# EAGLE schematic PGA2311module (EAGLE 6.4)
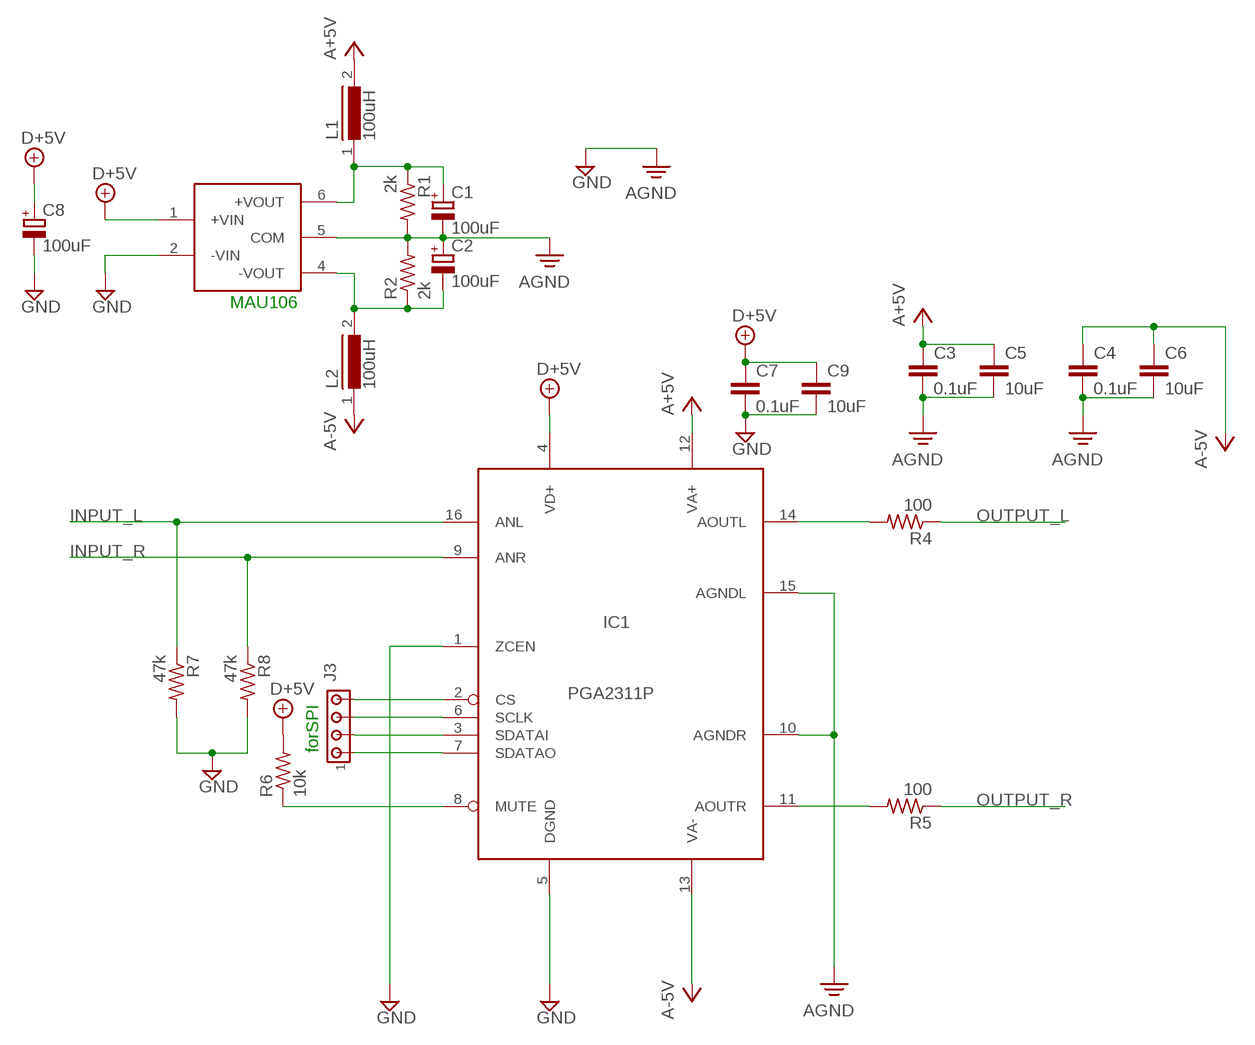
[diagram p0: schematic, sheet 1]

## Parts
C1  100uF  CPOL-EUE5-8.5  [E5-8,5]
C2  100uF  CPOL-EUE5-8.5  [E5-8,5]
C3  0.1uF  C-EU050-030X075  [C050-030X075]
C4  0.1uF  C-EU050-030X075  [C050-030X075]
C5  10uF  C-EU050-030X075  [C050-030X075]
C6  10uF  C-EU050-030X075  [C050-030X075]
C7  0.1uF  C-EU050-030X075  [C050-030X075]
C8  100uF  CPOL-EUE5-8.5  [E5-8,5]
C9  10uF  C-EU050-030X075  [C050-030X075]
IC1  PGA2311P  [DIL16]
J3  MTA04-156  [1X4MTA]
L1  100uH  82114R  [82114R]
L2  100uH  82114R  [82114R]
R1  2k  R-US_0411/15  [0411/15]
R2  2k  R-US_0411/15  [0411/15]
R4  100  R-US_0411/15  [0411/15]
R5  100  R-US_0411/15  [0411/15]
R6  10k  R-US_0411/15  [0411/15]
R7  47k  R-US_0411/15  [0411/15]
R8  47k  R-US_0411/15  [0411/15]
U$1  MAU106  [MAU106]

## Nets
+5V: C7.1 C8.+ C9.1 IC1.4(VD+) R6.2 U$1.1(+VIN) ; supply symbol labelled D+5V
-5V: C4.1 C6.1 IC1.13(VA-) L2.1 ; supply symbol labelled A-5V
GND: C7.2 C8.- C9.2 IC1.1(ZCEN) IC1.5(DGND) R7.2 R8.2 U$1.2(-VIN)
INPUT_L: IC1.16(ANL) R7.1
INPUT_R: IC1.9(ANR) R8.1
N$1: C1.+ L1.1 R1.1 U$1.6(+VOUT)
N$2: C2.- L2.2 R2.1 U$1.4(-VOUT)
N$9: IC1.2(CS) J3.4
N$12: IC1.6(SCLK) J3.3
N$13: IC1.14(AOUTL) R4.2
N$14: IC1.11(AOUTR) R5.2
N$23: IC1.8(MUTE) R6.1
N$24: IC1.3(SDATAI) J3.2
N$25: IC1.7(SDATAO) J3.1
OUTPUT_L: R4.1
OUTPUT_R: R5.1
PE: C1.- C2.+ C3.2 C4.2 C5.2 C6.2 IC1.10(AGNDR) IC1.15(AGNDL) R1.2 R2.2 U$1.5(COM) ; supply symbol labelled AGND, GND
VCC: C3.1 C5.1 IC1.12(VA+) L1.2 ; supply symbol labelled A+5V

## Notes on the sheet
- MAU106
- forSPI

## Library data of the parts
C1 C2 C8 = rcl:CPOL-EU: POLARIZED CAPACITOR, European symbol
C3-C7 C9 = rcl:C-EU: CAPACITOR, European symbol
IC1 = PGA2311:PGA2311
J3 = con-amp:MTA04-156: AMP connector
L1 L2 = inductors:82114R: INDUCTOR
R1 R2 R4-R8 = resistor:R-US_: RESISTOR, American symbol
U$1 = MAU106:MAU106